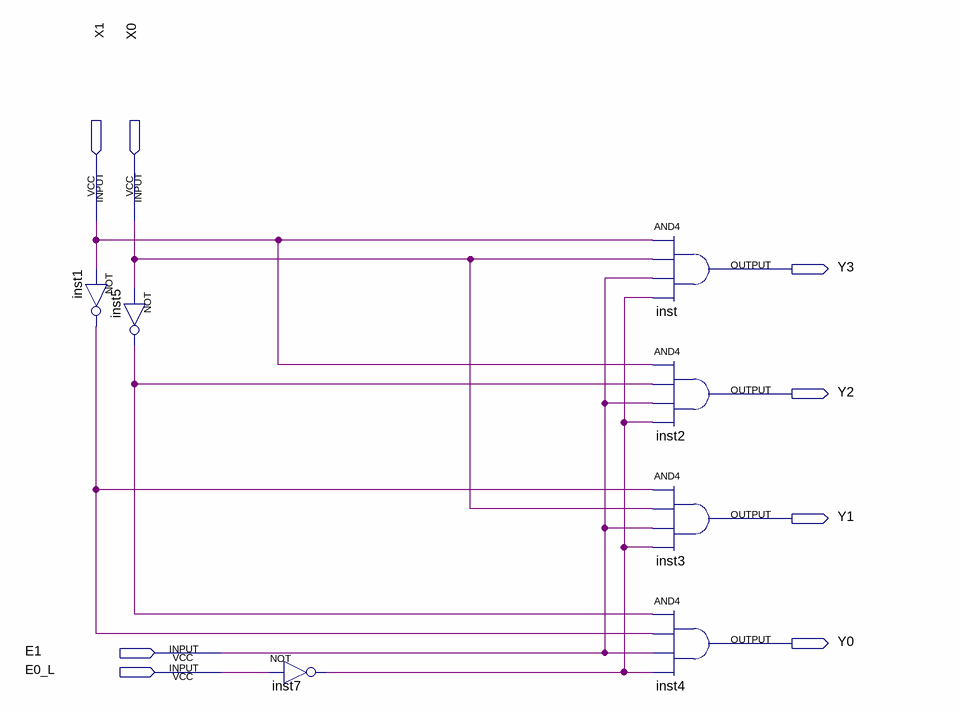
[diagram p0: schematic sheet]
// Quartus schematic Dec2_4.bdf as structural Verilog: 7 symbols, 8 pins
module Dec2_4 (
  input  X1,
  input  X0,
  input  E1,
  input  E0_L,
  output Y3,
  output Y2,
  output Y1,
  output Y0
);

  wire inst1_out, inst5_out, inst7_out;

  not inst1 (inst1_out, X1);
  not inst5 (inst5_out, X0);
  not inst7 (inst7_out, E0_L);
  and inst (Y3, X1, X0, E1, inst7_out);
  and inst2 (Y2, X1, inst5_out, E1, inst7_out);
  and inst3 (Y1, inst1_out, X0, E1, inst7_out);
  and inst4 (Y0, inst5_out, inst1_out, E1, inst7_out);
endmodule
